# Altium schematic sheet CAN.SchDoc: CAN
size A4; DocumentNumber: MB1144; Revision: C-02; SheetNumber: 16; SheetTotal: 25; Project: STM32L476G-EVAL; ModifiedDate: 9/23/2015
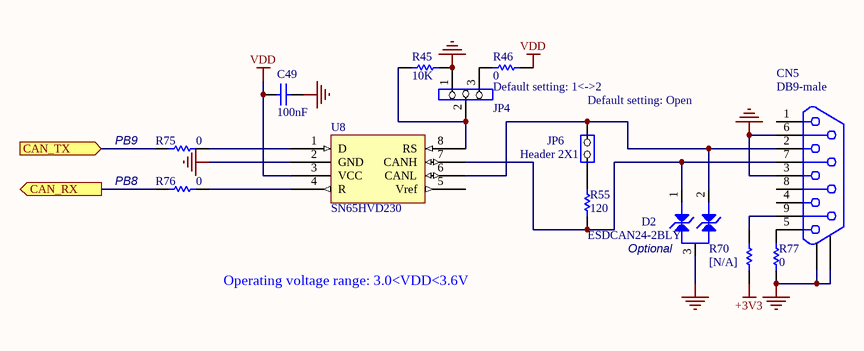
[diagram p0: CAN.SchDoc]

## Parts
C49  100nF  [0402C]
CN5  DB9-male  [DB9/M]
D2  ESDCAN24-2BLY  [SOT23-213]
JP4  Header 3X1  [SIP3]  (value not drawn)
JP6  Header 2X1  [SIP2]
R45  10K  [0402R]
R46  0  [0603R]
R55  120  [0402R]
R70  [N/A]  [0603R]
R75  0  [0603R]
R76  0  [0603R]
R77  0  [0603R]
U8  SN65HVD230  [SOIC8_1R27_4R9X6]

## Ports
CAN_RX (out), CAN_TX (in)

## Nets
+3V3: R70.1
GND: C49.1 CN5.3 CN5.6 CN5.10 CN5.11 D2.3 JP4.1 R45.2 R77.1 U8.2(GND)
VDD: C49.2 R46.2 U8.3(VCC)
CAN_RX: R76.1 ; port CAN_RX
CAN_TX: R75.2 ; port CAN_TX
NetCN5_2: CN5.2 D2.2 JP6.2(NO) U8.6(CANL)
NetCN5_5: CN5.5 R77.2
NetCN5_7: CN5.7 D2.1 R55.1 U8.7(CANH)
NetCN5_9: CN5.9 R70.2
NetJP4_2: JP4.2 R45.1 U8.8(RS)
NetJP4_3: JP4.3 R46.1
NetJP6_1: JP6.1(COMMON) R55.2
NetR75_1: R75.1 U8.1(D)
NetR76_2: R76.2 U8.4(R)

Not connected (* = marked no-connect by the designer): CN5 1 4 8; U8 5(Vref)

## Notes on the sheet
- Default setting: 1<->2
- (near JP6) Default setting: Open
- PB9
- PB8
- (near D2) Optional
- Operating voltage range: 3.0<VDD<3.6V
- Title:
- Project:
- Size:
- Date:
- A4
- Reference:
- Sheet:
- Revision:
- of

## Library data of the parts
C49 = CAP: Capacitor; Ordered by: Subcon; ECCN_US/EU: NA; Published: 8-Jun-2000; Revision: July-2002: Re-released for DXP Platform.; Publisher: Altium Limited; Value: 100nF
CN5 = DB9: Ordered by: Subcon; Comments: DB9 CAN; ECCN_US/EU: NA
D2 = ESDCAN24-2BLY: Ordered by: ST; ECCN_US/EU: EAR99/NEC; Ref St: 9179002; Manuf_1: ST; Manuf_Part_1: ESDCAN24-2BLY
JP4 = Jumper3: Ordered by: Subcon; ECCN_US/EU: NA
JP6 = JP2: Ordered by: Subcon; ECCN_US/EU: NA
R45 R46 R55 R77 = res1: Resistor; Value: 1K; Ordered by: Subcon; ECCN_US/EU: NA; Published: 8-Jun-2000; Revision: July-2002: Re-released for DXP Platform.; Publisher: Altium Limited
R70 = res1: Resistor; Value: 1K; Ordered by: Subcon; ECCN_US/EU: NA; Fitted: NO; Published: 8-Jun-2000; Revision: July-2002: Re-released for DXP Platform.; Publisher: Altium Limited
R75 R76 = Res1: Resistor; Value: 1K; Ordered by: Subcon; ECCN_US/EU: NA; Published: 8-Jun-2000; Revision: July-2002: Re-released for DXP Platform.; Publisher: Altium Limited
U8 = SN65HVD230D: Manuf_1: TI; Ordered by: Subcon; ECCN_US/EU: EAR99/NEC; Comments: QSPI memory; Manuf_Part_1: SN65HVD230